# Altium schematic sheet Block Diagram.SchDoc
size 420 x 297 mm
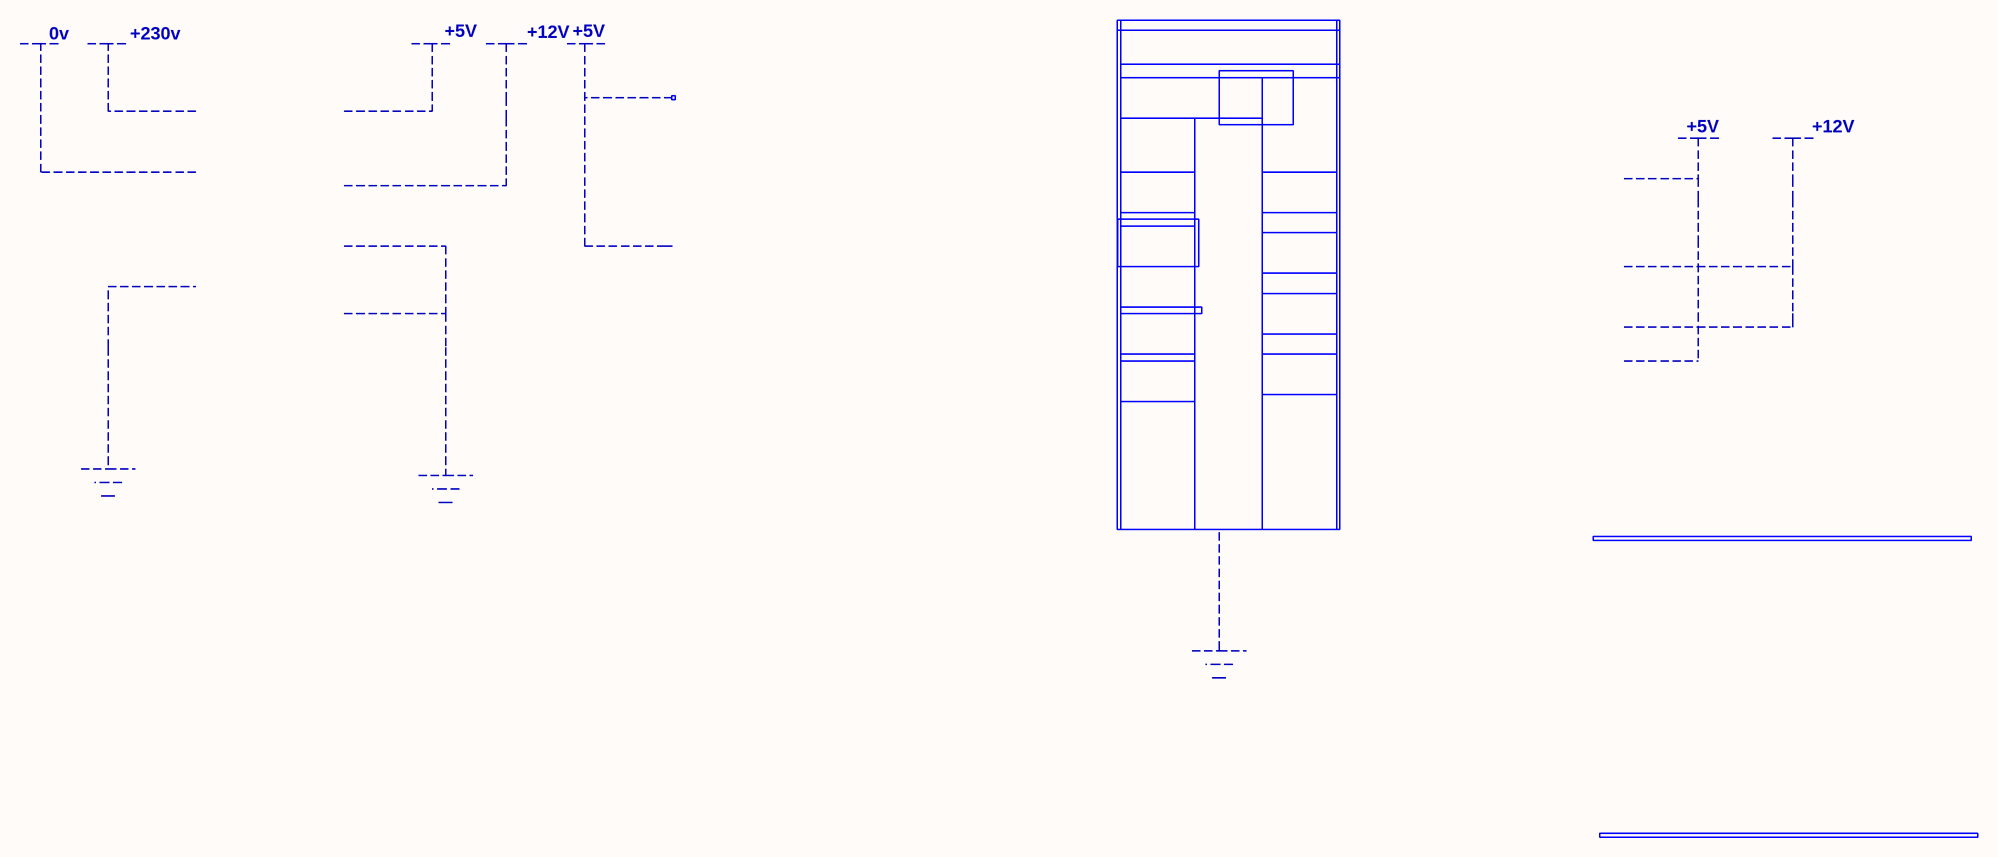
[diagram p0: Block Diagram.SchDoc]

## Notes on the sheet
- 0v
- +230v
- +5V
- +12V
- 1
- 2
- 3
- 4
- 5
- 6
- 7
- 8
- A
- B
- C
- D
- E
- Title: Block Diagram
- File: Block Diagram.kicad_sch
- Sheet: /
- ${COMPANY}
- F
- KiCad E.D.A.  kicad (5.1.4)-1
- Size: A3
- Date: Last Modified Date
- Rev: ${REVISION}
- Id: 1/1